# EasyEDA Pro project Avian.epro, schematic Avian_1

## Sheets
1 Power and sensors: Board Name: Avian_1; Create Date: 2026-01-29; Page Name: Power and sensors; Project Name: Avian; Schematic Name: Avian_1; Update Date: 2026-02-02; Company: EasyEDA.com; Page Size: A4; Version: V1.0
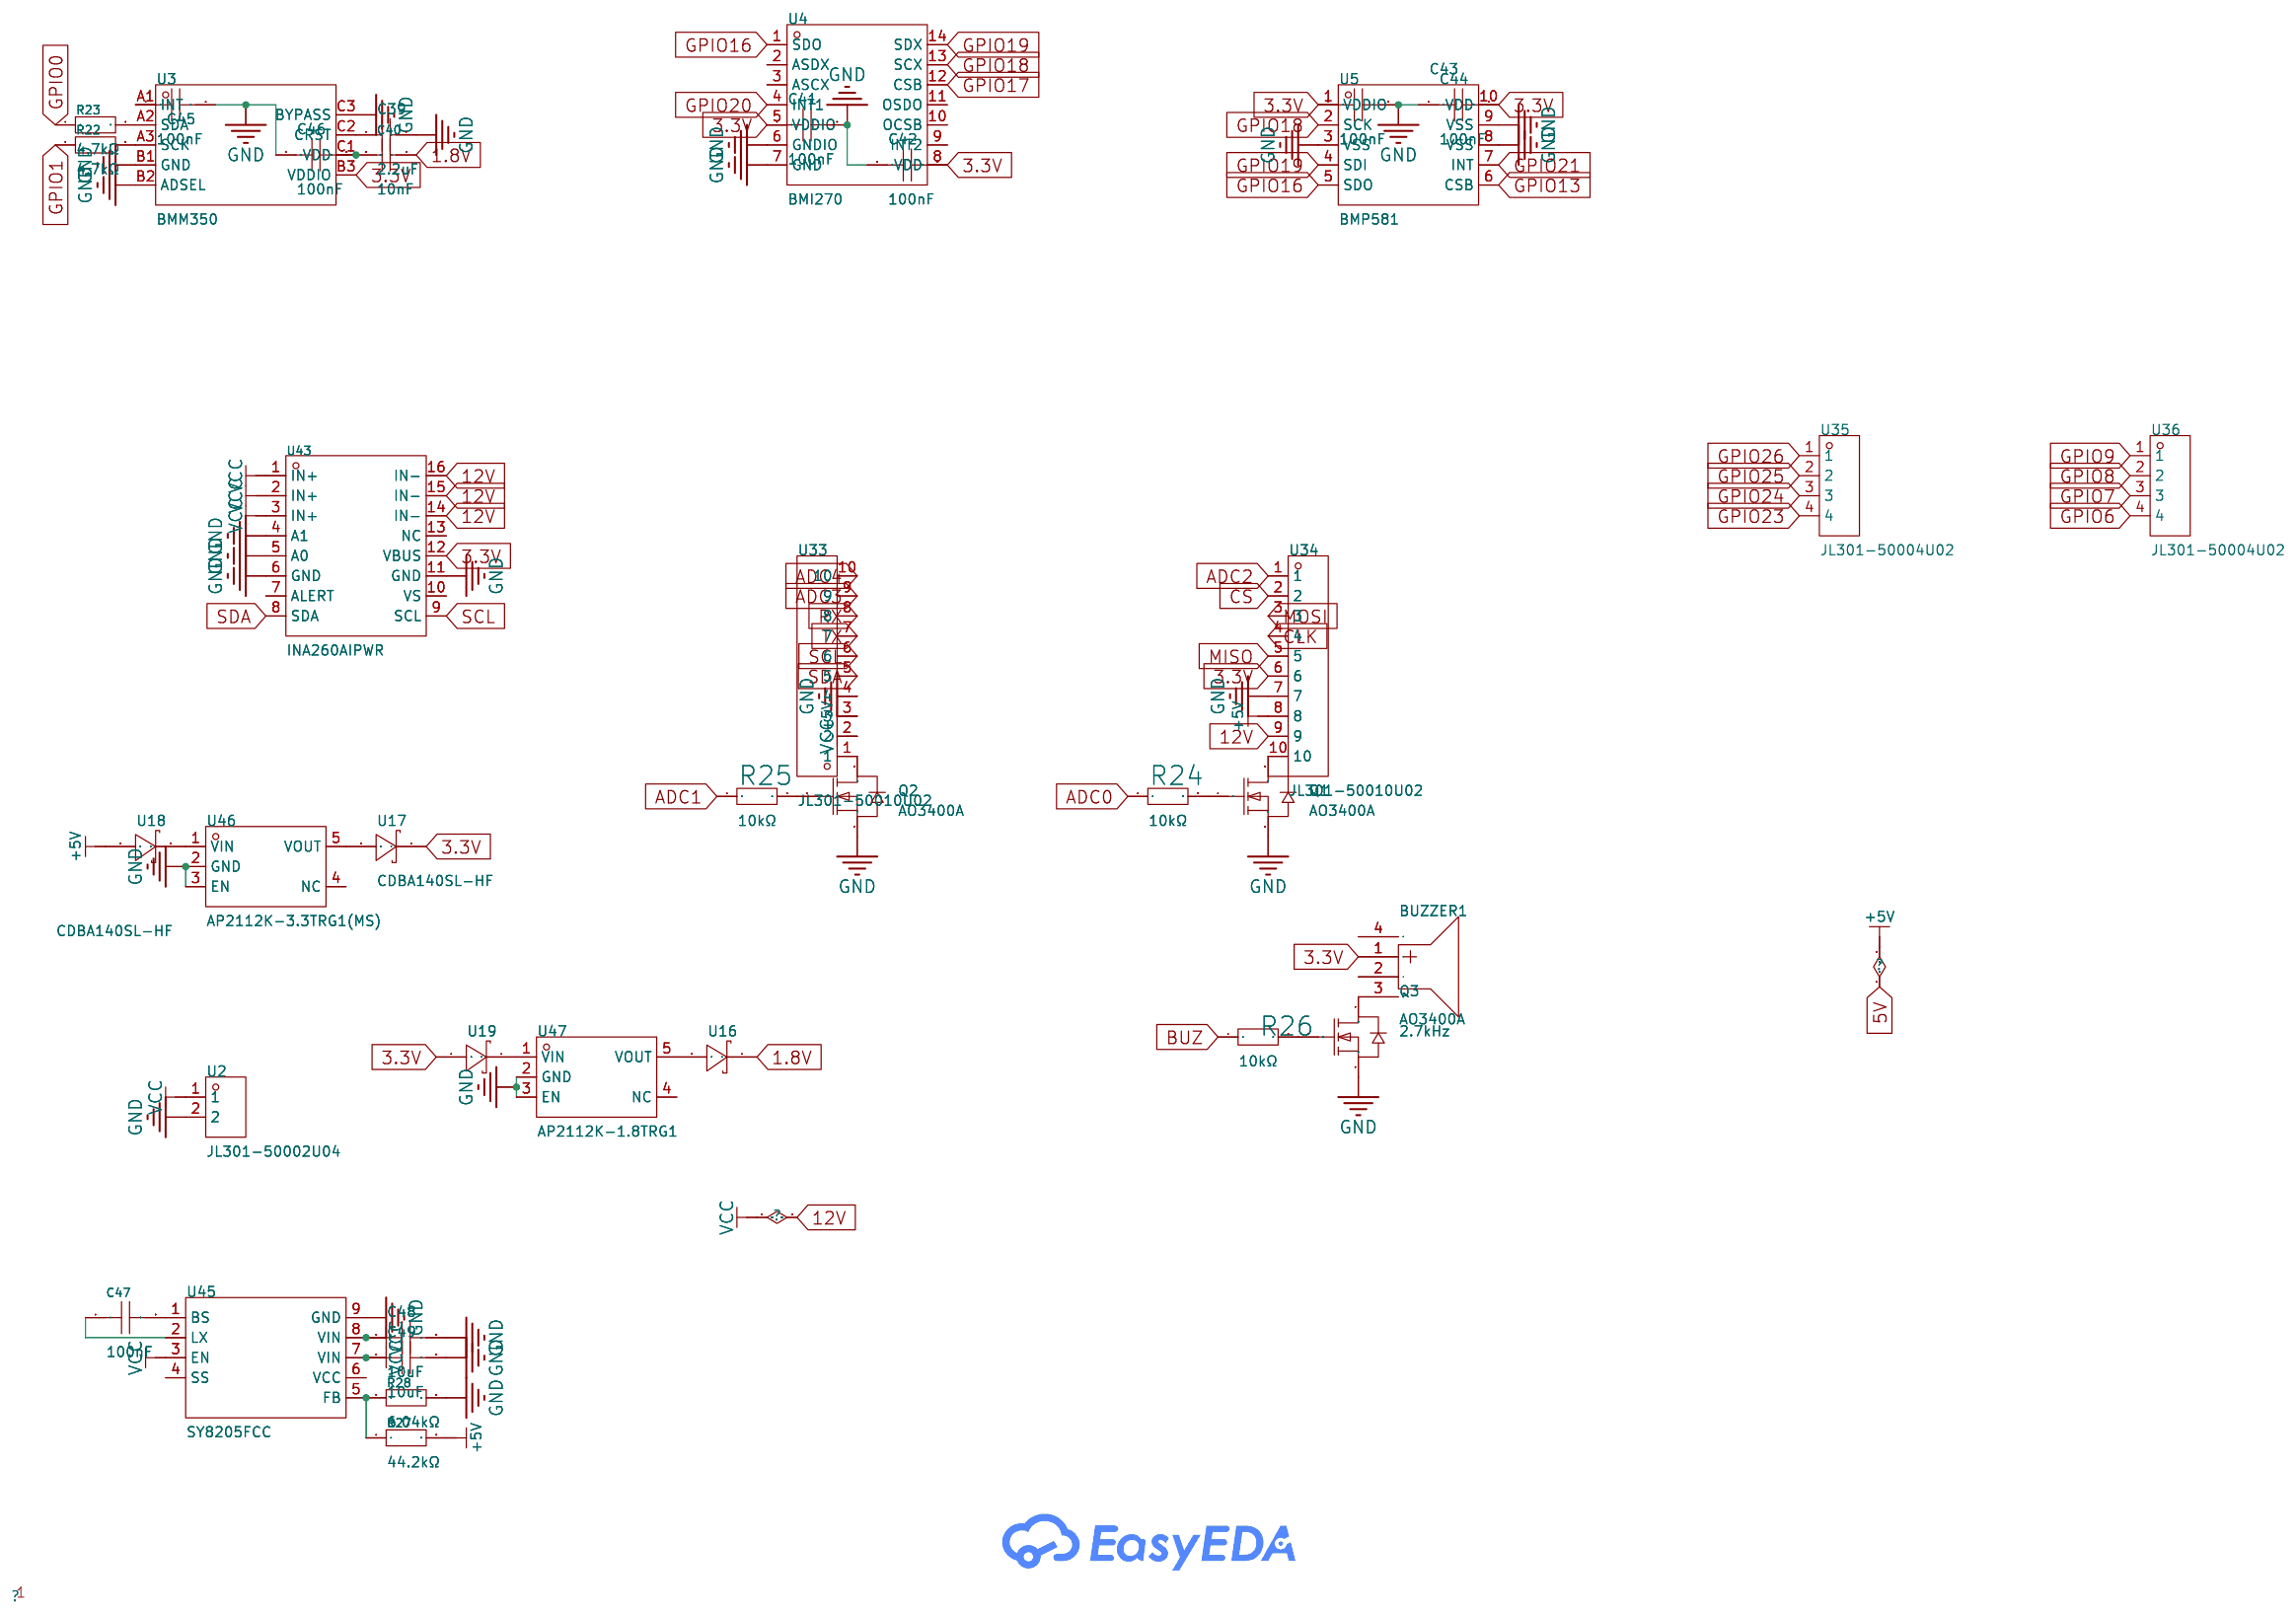
[diagram p0: Power and sensors]
2 MRPI: Page Name: MRPI; Update Date: 2026-02-01
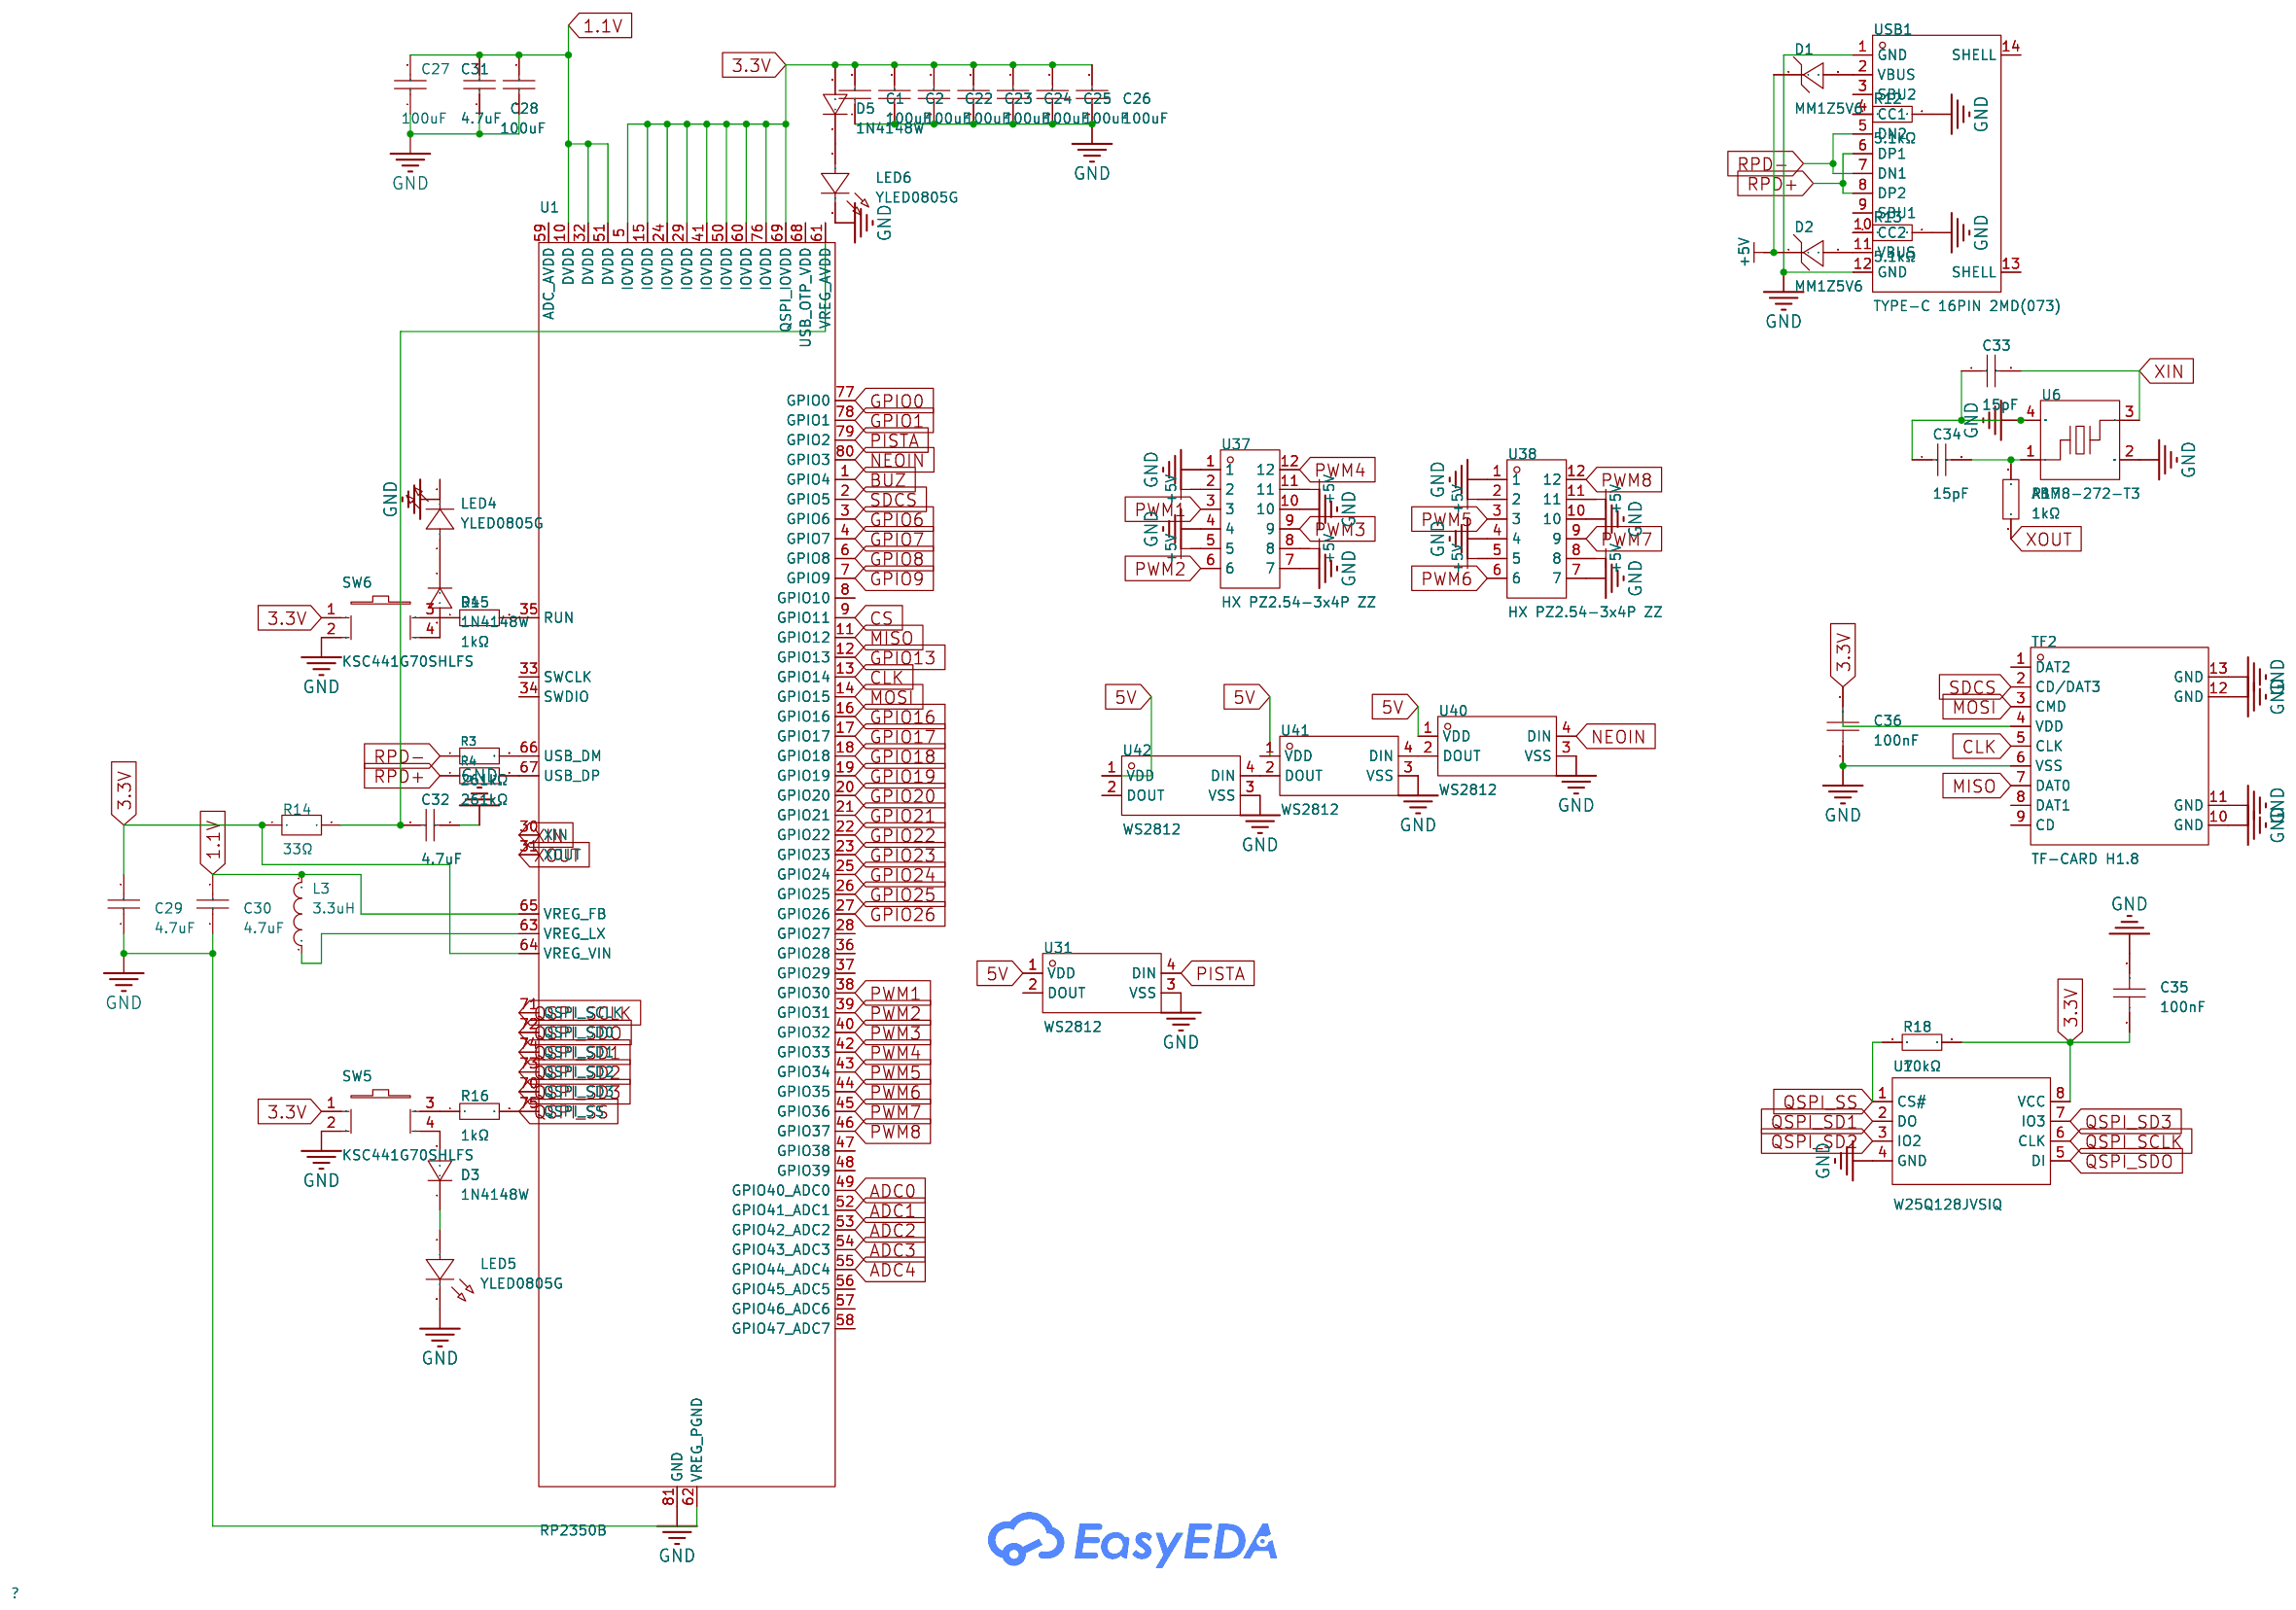
[diagram p1: MRPI]

## Parts
sheet MRPI
C1  100uF  [C1206]
C2  100uF  [C1206]
C22  100uF  [C1206]
C23  100uF  [C1206]
C24  100uF  [C1206]
C25  100uF  [C1206]
C26  100uF  [C1206]
C27  100uF  [C1206]
C28  100uF  [C1206]
C29  4.7uF  [C1206]
C30  4.7uF  [C1206]
C31  4.7uF  [C1206]
C32  4.7uF  [C1206]
C33  15pF  [C0603]
C34  15pF  [C0603]
C35  100nF  [C0603]
C36  100nF  [C0603]
D1  MM1Z5V6  [SOD-123_L2.8-W1.8-LS3.7-RD]
D2  MM1Z5V6  [SOD-123_L2.8-W1.8-LS3.7-RD]
D3  1N4148W  [SOD-123F_L2.7-W1.6-LS3.8-RD]
D4  1N4148W  [SOD-123F_L2.7-W1.6-LS3.8-RD]
D5  1N4148W  [SOD-123F_L2.7-W1.6-LS3.8-RD]
L3  3.3uH  [IND-SMD_L2.0-W1.6_AOTA-B201610S3R3-101-T]
LED4  YLED0805G  [LED0805-FD-GREEN]
LED5  YLED0805G  [LED0805-FD-GREEN]
LED6  YLED0805G  [LED0805-FD-GREEN]
R3  261kΩ  [R0603]
R4  261kΩ  [R0603]
R12  5.1kΩ  [R0805]
R13  5.1kΩ  [R0805]
R14  33Ω  [R0603]
R15  1kΩ  [R0603]
R16  1kΩ  [R0603]
R17  1kΩ  [R0603]
R18  10kΩ  [R0603]
SW5  KSC441G70SHLFS  [KEY--SMD_4P-L6.2-W6.2-P4.50-LS12.0]
SW6  KSC441G70SHLFS  [KEY--SMD_4P-L6.2-W6.2-P4.50-LS12.0]
TF2  TF-CARD H1.8  [TF-SMD_TF-CARD-H1.8]
U1  RP2350B  [QFN-80_L10.0-W10.0-P0.40-TL-EP3.4]
U6  ABM8-272-T3  [CRYSTAL-SMD_4P-L3.2-W2.5-BL]
U7  W25Q128JVSIQ  [SOIC-8_L5.3-W5.3-P1.27-LS8.0-BL]
U31  WS2812  [LED-SMD_4P-L5.0-W5.0-TL-A]
U37  HX PZ2.54-3x4P ZZ  [HDR-TH_12P-P2.54-V-M-R3-C4-S2.54]
U38  HX PZ2.54-3x4P ZZ  [HDR-TH_12P-P2.54-V-M-R3-C4-S2.54]
U40  WS2812  [LED-SMD_4P-L5.0-W5.0-TL-A]
U41  WS2812  [LED-SMD_4P-L5.0-W5.0-TL-A]
U42  WS2812  [LED-SMD_4P-L5.0-W5.0-TL-A]
USB1  TYPE-C 16PIN 2MD(073)  [USB-C-SMD_TYPE-C-6PIN-2MD-073]
sheet Power and sensors
BUZZER1  2.7kHz  [BUZ-SMD_4P-L7.5-W7.5-P7.59-TL]
C39  2.2uF  [C1206]
C40  10nF  [C0603]
C41  100nF  [C0603]
C42  100nF  [C0603]
C43  100nF  [C0603]
C44  100nF  [C0603]
C45  100nF  [C0603]
C46  100nF  [C0603]
C47  100nF  [C0603]
C48  10uF  [C0805]
C49  10uF  [C0805]
Q1  AO3400A  [SOT-23-3_L2.9-W1.3-P1.90-LS2.4-BR]
Q2  AO3400A  [SOT-23-3_L2.9-W1.3-P1.90-LS2.4-BR]
Q3  AO3400A  [SOT-23-3_L2.9-W1.3-P1.90-LS2.4-BR]
R22  4.7kΩ  [R1206]
R23  4.7kΩ  [R1206]
R24  10kΩ  [R0603]
R25  10kΩ  [R0603]
R26  10kΩ  [R0603]
R27  44.2kΩ  [R0402]
R28  6.04kΩ  [R0402]
U2  JL301-50002U04  [CONN-TH_JL301-50002U01]
U3  BMM350  [WLCSP-9_L1.3-W1.3-R3-C3-P0.40-TL]
U4  BMI270  [LGA-14_L3.0-W2.5-P0.50-BR]
U5  BMP581  [LGA-10_L2.0-W2.0-P0.50-TL_BMP581]
U16  CDBA140SL-HF  [DO-214AC_L4.3-W2.7-LS5.3-RD]
U17  CDBA140SL-HF  [DO-214AC_L4.3-W2.7-LS5.3-RD]
U18  CDBA140SL-HF  [DO-214AC_L4.3-W2.7-LS5.3-RD]
U19  CDBA140SL-HF  [DO-214AC_L4.3-W2.7-LS5.3-RD]
U33  JL301-50010U02  [CONN-TH_10P-P5.00_JL301-50010U02]
U34  JL301-50010U02  [CONN-TH_10P-P5.00_JL301-50010U02]
U35  JL301-50004U02  [CONN-TH_4P-P5.00_JL301-50004U02]
U36  JL301-50004U02  [CONN-TH_4P-P5.00_JL301-50004U02]
U43  INA260AIPWR  [TSSOP-16_L5.0-W4.4-P0.65-LS6.4-BL-1]
U45  SY8205FCC  [SOIC-8_L5.0-W4.0-P1.27-LS6.0-BL-EP2.0]
U46  AP2112K-3.3TRG1(MS)  [SOT-23-5_L2.9-W1.6-P0.95-LS2.7-BR]
U47  AP2112K-1.8TRG1  [SOT-25_L3.0-W1.6-P0.95-LS2.8-BL]

## Library data of the parts
C1 C2 C22-C28 = CL31A107MQHNNNE: Capacitance:100uF Tolerance:±20% Tolerance:±20% Voltage Rating:6.3V Temperature Coefficient:X5R; LCSC Part Name: 100uF ±20% 6.3V; Supplier Part: C15008; Manufacturer: SAMSUNG(三星); Supplier Footprint: 1206; Datasheet: https://item.szlcsc.com/datasheet/CL31A107MQHNNNE/15681.html; Supplier: LCSC; Tolerance: ±20%; Voltage Rating: 6.3V; Temperature Coefficient: X5R
C29-C32 = CL31B475KBHNNNE: Capacitance:4.7uF Tolerance:±10% Tolerance:±10% Voltage Rating:50V Temperature Coefficient:X7R; LCSC Part Name: 4.7uF ±10% 50V; Supplier Part: C51205; Manufacturer: SAMSUNG(三星); Supplier Footprint: 1206; Datasheet: https://item.szlcsc.com/datasheet/CL31B475KBHNNNE/52218.html; Supplier: LCSC; Tolerance: ±10%; Voltage Rating: 50V; Temperature Coefficient: X7R
C33 C34 = CL10C150JB8NNNC: Capacitance:15pF Tolerance:±5% Tolerance:±5% Voltage Rating:50V Temperature Coefficient:C0G; LCSC Part Name: 15pF ±5% 50V; Supplier Part: C1644; Manufacturer: SAMSUNG(三星); Supplier Footprint: 0603; JLCPCB Part Class: Basic Part; Datasheet: https://item.szlcsc.com/datasheet/CL10C150JB8NNNC/1996.html; Supplier: LCSC; Tolerance: ±5%; Voltage Rating: 50V; Temperature Coefficient: C0G
C35 C36 C41-C46 = CC0603KRX7R9BB104: Capacitance:100nF Tolerance:±10% Tolerance:±10% Voltage Rating:50V Temperature Coefficient:X7R; LCSC Part Name: 100nF ±10% 50V; Supplier Part: C14663; Manufacturer: YAGEO(国巨); Supplier Footprint: 0603; Datasheet: https://item.szlcsc.com/datasheet/CC0603KRX7R9BB104/15331.html; Supplier: LCSC; Tolerance: ±10%; Voltage Rating: 50V; Temperature Coefficient: X7R
D1 D2 = MM1Z5V6_C85210: Diode Configuration:Independent Type Zener Voltage (Nom):5.6V Reverse Leakage Current (Ir):1uA@2.5V Zener Voltage (Range):5.2V~6V Zener Voltage (Range):5.2V~6V Power Dissipation:500mW Zener Impedance (Zzt):80Ω; Supplier Part: C85210; Manufacturer: ST(先科); Supplier Footprint: SOD-123; Datasheet: https://atta.szlcsc.com/upload/public/pdf/source/20170914/C118610_1505373983764968880.pdf; Supplier: LCSC; Diode Configuration: Independent Type; Zener Voltage (Nom): 5.6V; Reverse Leakage Current (Ir): 1uA@2.5V; Zener Voltage (Range): 5.2V~6V; Power Dissipation: 500mW; Zener Impedance (Zzt): 80Ω
D3-D5 = 1N4148W_C81598: Diode Configuration:Independent Voltage - Forward(Vf@If):1V@50mA Voltage - DC Reverse(Vr):75V Current - Rectified:150mA Pd - Power Dissipation:400mW Reverse Leakage Current (Ir):1uA@75V Reverse Recovery Time (trr):4ns Operating Junction Temperature Range:; Supplier Part: C81598; Manufacturer: ST(先科); Supplier Footprint: SOD-123; JLCPCB Part Class: Basic Part; Datasheet: https://item.szlcsc.com/datasheet/1N4148W/82750.html; Supplier: LCSC; Diode Configuration: Independent; Voltage - Forward(Vf@If): 1V@50mA; Voltage - DC Reverse(Vr): 75V; Current - Rectified: 150mA; Pd - Power Dissipation: 400mW; Reverse Leakage Current (Ir): 1uA@75V; Reverse Recovery Time (trr): 4ns; Non-Repetitive Peak Forward Surge Current: 1A
L3 = AOTA-B201610S3R3-101-T: Inductance:3.3uH Current Rating:2.1A Current - Saturation(Isat):2.4A DC Resistance(DCR):115mΩ Type:Molded Inductor; LCSC Part Name: 3.3uH 2.4A; Supplier Part: C42411119; Manufacturer: ABRACON; Supplier Footprint: 0806; JLCPCB Part Class: Extended Part; Datasheet: https://item.szlcsc.com/datasheet/AOTA-B201610S3R3-101-T/44392932.html; Supplier: LCSC; Current Rating: 2.1A; Current - Saturation(Isat): 2.4A; DC Resistance(DCR): 115mΩ; Type: Molded Inductor
LED4-LED6 = YLED0805G: Lamp Holder Type:-；- Illumination Color:Emerald Green Voltage - Forward(Vf):2.4V~3.1V Voltage - Forward(Vf):2.4V~3.1V Power(Watts):70mW Forward Current:20mA Wavelength - Dominant:516nm~534nm Wavelength - Dominant:516nm~534nm Peak Wavelength:525nm Diode Co; LCSC Part Name: 发光管; Supplier Part: C25170728; Manufacturer: YONGYUTAI(永裕泰); Supplier Footprint: 0805; JLCPCB Part Class: Extended Part; Datasheet: https://item.szlcsc.com/datasheet/YLED0805G/26899175.html; Supplier: LCSC; Lamp Holder Type: -；-; Illumination Color: Emerald Green; Voltage - Forward(Vf): 2.4V~3.1V; Power(Watts): 70mW; Forward Current: 20mA; Wavelength - Dominant: 516nm~534nm; Peak Wavelength: 525nm; Diode Configuration: -；-; Lens Color: -；-; Luminous Intensity: 430mcd; Viewing Angle: 120°; Mounting Style: -；-; Operating Temperature: -40℃~+85℃
R3 R4 = 0603WAF2613T5E: Type:Thick Film Resistors Resistance:261kΩ Tolerance:±1% Tolerance:±1% Power(Watts): Overload Voltage (Max): Temperature Coefficient:±100ppm/℃ Temperature Coefficient:±100ppm/℃ Operating Temperature Range:-55℃~+155℃ Operating Temperature Range:-55℃~+155℃; LCSC Part Name: 261kΩ ±1% 100mW 厚膜电阻; Supplier Part: C23011; Manufacturer: UNI-ROYAL(厚声); Supplier Footprint: 0603; JLCPCB Part Class: Extended Part; Datasheet: https://atta.szlcsc.com/upload/public/pdf/source/20200306/C422600_1E6D84923E4A46A82E41ADD87F860B5C.pdf; Supplier: LCSC; Type: Thick Film Resistors; Tolerance: ±1%; Temperature Coefficient: ±100ppm/℃; Operating Temperature Range: -55℃~+155℃
R12 R13 = 0805W8F5101T5E: Type:Thick Film Resistor Resistance:5.1kΩ Tolerance:±1% Tolerance:±1% Power(Watts):125mW Voltage-Supply(Max):150V Temperature Coefficient:±100ppm/℃ Temperature Coefficient:±100ppm/℃ Operating Temperature:-55℃~+155℃ Operating Temperature:-55℃~+155℃; LCSC Part Name: 5.1kΩ ±1% 125mW 厚膜电阻; Supplier Part: C27834; Manufacturer: UNI-ROYAL(厚声); Supplier Footprint: 0805; JLCPCB Part Class: Basic Part; Datasheet: https://item.szlcsc.com/datasheet/0805W8F5101T5E/28584.html; Supplier: LCSC; Type: Thick Film Resistor; Tolerance: ±1%; Power(Watts): 125mW; Voltage-Supply(Max): 150V; Temperature Coefficient: ±100ppm/℃; Operating Temperature: -55℃~+155℃
R14 = FRC0603F33R0TS: Type:Thick Film Resistor Resistance:33Ω Tolerance:±1% Tolerance:±1% Power(Watts):100mW Voltage-Supply(Max):75V Temperature Coefficient:±100ppm/℃ Temperature Coefficient:±100ppm/℃ Operating Temperature:-55℃~+155℃ Operating Temperature:-55℃~+155℃; LCSC Part Name: 33Ω ±1% 100mW 厚膜电阻; Supplier Part: C2909394; Manufacturer: FOJAN(富捷); Supplier Footprint: 0603; JLCPCB Part Class: Extended Part; Supplier: LCSC; Type: Thick Film Resistor; Tolerance: ±1%; Power(Watts): 100mW; Voltage-Supply(Max): 75V; Temperature Coefficient: ±100ppm/℃; Operating Temperature: -55℃~+155℃
R15-R17 = RC0603FR-071KL: Type:Thick Film Resistor Resistance:1kΩ Tolerance:±1% Tolerance:±1% Power(Watts):100mW Voltage-Supply(Max):75V Temperature Coefficient:±100ppm/℃ Temperature Coefficient:±100ppm/℃ Operating Temperature:-55℃~+155℃ Operating Temperature:-55℃~+155℃; LCSC Part Name: 厚膜电阻 1kΩ ±1% 100mW; Supplier Part: C22548; Manufacturer: YAGEO(国巨); Supplier Footprint: 0603; JLCPCB Part Class: Extended Part; Datasheet: https://item.szlcsc.com/datasheet/RC0603FR-071KL/23274.html; Supplier: LCSC; Type: Thick Film Resistor; Tolerance: ±1%; Power(Watts): 100mW; Voltage-Supply(Max): 75V; Temperature Coefficient: ±100ppm/℃; Operating Temperature: -55℃~+155℃
R18 = RC0603FR-0710KL: Type:Thick Film Resistors Resistance: Tolerance:±1% Tolerance:±1% Power(Watts): Overload Voltage (Max): Temperature Coefficient:±100ppm/℃ Temperature Coefficient:±100ppm/℃ Operating Temperature Range:-55℃~+155℃ Operating Temperature Range:-55℃~+155℃; LCSC Part Name: 厚膜电阻 10kΩ ±1% 100mW; Supplier Part: C98220; Manufacturer: YAGEO(国巨); Supplier Footprint: 0603; JLCPCB Part Class: Extended Part; Datasheet: https://atta.szlcsc.com/upload/public/pdf/source/20180927/C295883_E8D83085EA81BD7DE0B2B681138C15EE.pdf; Supplier: LCSC; Type: Thick Film Resistors; Tolerance: ±1%; Temperature Coefficient: ±100ppm/℃; Operating Temperature Range: -55℃~+155℃
SW5 SW6 = KSC441G70SHLFS: Circuit:SPST Actuator Style:Round Button Operating Force:4N Mounting Type:Surface Mount,Vertical Length:6.2mm Width:6.2mm Switch Height:5.2mm Contact Current:50mA Voltage Rating:32V With Lamp:- IP Rating:IP67 Termination Style:Gull Wing Life:- Operating T; LCSC Part Name: 轻触开关6.2mm*6.2mm，4N; Supplier Part: C221747; Manufacturer: C&K; Supplier Footprint: SMD-4P,6.2x6.2mm; JLCPCB Part Class: Extended Part; Datasheet: https://item.szlcsc.com/datasheet/KSC441G70SHLFS/222177.html; Supplier: LCSC; Circuit: SPST; Actuator Style: Round Button; Operating Force: 4N; Mounting Type: Surface Mount,Vertical; Length: 6.2mm; Width: 6.2mm; Switch Height: 5.2mm; Contact Current: 50mA; Voltage Rating: 32V; IP Rating: IP67; Termination Style: Gull Wing; Operating Temperature: -40℃~+85℃
TF2 = TF-CARD H1.8: Card Connection Mode:Push-Push Card Type:MicroSD Card (TF Card) Connector Type:Connector and Ejector Additional Card Detection Pins:- Supplementary Features:- Height Above Board:1.8mm Operating Temperature:-40℃~+70℃ Operating Temperature:-40℃~+70℃; LCSC Part Name: 自弹式 MicroSD卡(TF卡) 卡座; Supplier Part: C7529389; Manufacturer: SHOU HAN(首韩); Supplier Footprint: SMD; Datasheet: https://item.szlcsc.com/datasheet/TF-CARD%2520H1.8/8629776.html; Supplier: LCSC; Card Connection Mode: Push-Push; Card Type: MicroSD Card (TF Card); Connector Type: Connector and Ejector; Height Above Board: 1.8mm; Operating Temperature: -40℃~+70℃
U1 = RP2350B_C42415655: LCSC Part Name: 微控制器; Supplier Part: C42415655; Manufacturer: Raspberry Pi(树莓派); Supplier Footprint: QFN-80-EP(10x10); JLCPCB Part Class: Extended Part; Datasheet: https://item.szlcsc.com/datasheet/RP2350B/44413055.html; Supplier: LCSC
U6 = ABM8-272-T3_C20625731: Supplier Part: C20625731; Manufacturer: ABRACON; Supplier Footprint: SMD3225-4P; JLCPCB Part Class: Extended Part; Datasheet: https://item.szlcsc.com/datasheet/ABM8-272-T3/22032038.html; Supplier: LCSC
U7 = W25Q128JVSIQ: Interface:SPI Memory Size:128Mbit Clock Frequency:133MHz Voltage - Supply:2.7V~3.6V Voltage - Supply:2.7V~3.6V Standby Supply Current:1uA Program / Erase Cycles:100,000 Cycles Page Programming Time (Tpp):3ms Block Erase Time(tBE):120ms@(32KB) Data Retenti; LCSC Part Name: 编带 支持双路/四路SPI接口的3V、128Mbit 串行闪存; Supplier Part: C97521; Manufacturer: Winbond(华邦); Supplier Footprint: SOIC-8-208mil; JLCPCB Part Class: Basic Part; Datasheet: https://item.szlcsc.com/datasheet/W25Q128JVSIQ/98729.html; Supplier: LCSC; Interface: SPI; Memory Size: 128Mbit; Clock Frequency: 133MHz; Voltage - Supply: 2.7V~3.6V; Standby Supply Current: 1uA; Program / Erase Cycles: 100,000 Cycles; Page Programming Time (Tpp): 3ms; Block Erase Time(tBE): 120ms@(32KB); Data Retention - TDR (Year): 20 Years; Operating Temperature: -40℃~+85℃
U31 U40-U42 = WS2812: Supplier Part: C42417498; Manufacturer: worldsemi; Supplier Footprint: SMD5050-4P; JLCPCB Part Class: Extended Part; Datasheet: https://item.szlcsc.com/datasheet/WS2812/44423158.html; Supplier: LCSC
U37 U38 = HX PZ2.54-3x4P ZZ: Pin Structure:3x4P Pitch:2.54mm Row Spacing:2.54mm Circluar Pins/Square Pins:Pin Header Mounting Type:Through Hole Number of Rows:3 Number of Pins:12P Current Rating:3A Voltage Rating (Max):1kV Length of Mating Pin:6mm Insulation Height:2.5mm Length of En; LCSC Part Name: 3x4P 间距:2.54mm 方针 直插; Supplier Part: C32713291; Manufacturer: hanxia(韩下); Supplier Footprint: 插件,P=2.54mm; JLCPCB Part Class: Extended Part; Datasheet: https://item.szlcsc.com/datasheet/HX%2520PZ2.54-3x4P%2520ZZ/34444571.html; Supplier: LCSC; Pin Structure: 3x4P; Pitch: 2.54mm; Row Spacing: 2.54mm; Circluar Pins/Square Pins: Pin Header; Mounting Type: Through Hole; Number of Rows: 3; Number of Pins: 12P; Current Rating: 3A; Voltage Rating (Max): 1kV; Length of Mating Pin: 6mm; Insulation Height: 2.5mm; Length of End Connection Pin: 3mm; Contact Material: Brass; Contact Plating: Gold; Operating Temperature: -40℃~+105℃; Color: Black
USB1 = TYPE-C 16PIN 2MD(073): Connector Type:Type-C Protocol Standard:- Gender:Female Mounting Type:Surface Mount, Right Angle Number of Contacts:16P Number of Ports:1 Current Rating-Power:3A Voltage Rating:5V Connect-Disconnect Life:5,000 Cycles Supplementary Features:- Center Height; LCSC Part Name: Type-C 母 卧贴; Supplier Part: C2765186; Manufacturer: SHOU HAN(首韩); Supplier Footprint: SMD; Datasheet: https://item.szlcsc.com/datasheet/TYPE-C%252016PIN%25202MD(073)/2901843.html; Supplier: LCSC; Connector Type: Type-C; Gender: Female; Mounting Type: Surface Mount, Right Angle; Number of Contacts: 16P; Number of Ports: 1; Current Rating-Power: 3A; Voltage Rating: 5V; Connect-Disconnect Life: 5,000 Cycles; Detection color: Black; Operating Temperature: -25℃~+85℃
BUZZER1 = MLT-7525: Driver Circuitry:Passive (Externally Driven) Technology:Electromagnetic Voltage Rating:3.6V Voltage - Supply:2.5V~4.5V Voltage - Supply:2.5V~4.5V Frequency:2.7kHz Current Consumption:95mA Sound Pressure Level(SPL):80dB Length:7.5mm Width:7.5mm Height:2.8m; LCSC Part Name: 无源(外部驱动) 电磁式 2.7kHz; Supplier Part: C95299; Manufacturer: 华能; Supplier Footprint: SMD,7.5x7.5mm; JLCPCB Part Class: Extended Part; Datasheet: https://item.szlcsc.com/datasheet/MLT-7525/96501.html; Supplier: LCSC; Driver Circuitry: Passive (Externally Driven); Technology: Electromagnetic; Voltage Rating: 3.6V; Voltage - Supply: 2.5V~4.5V; Current Consumption: 95mA; Sound Pressure Level(SPL): 80dB; Length: 7.5mm; Width: 7.5mm; Height: 2.8mm; Operating Temperature: -20℃~+70℃
C39 = CL31B225KBHNNNE: Capacitance:2.2uF Tolerance:±10% Tolerance:±10% Voltage Rating:50V Temperature Coefficient:X7R; LCSC Part Name: 2.2uF ±10% 50V; Supplier Part: C50254; Manufacturer: SAMSUNG(三星); Supplier Footprint: 1206; Datasheet: https://item.szlcsc.com/datasheet/CL31B225KBHNNNE/51263.html; Supplier: LCSC; Tolerance: ±10%; Voltage Rating: 50V; Temperature Coefficient: X7R
C40 = CC0603KRX7R9BB103: Capacitance:10nF Tolerance:±10% Tolerance:±10% Voltage Rating:50V Temperature Coefficient:X7R; LCSC Part Name: 10nF ±10% 50V; Supplier Part: C100042; Manufacturer: YAGEO(国巨); Supplier Footprint: 0603; JLCPCB Part Class: Extended Part; Datasheet: https://item.szlcsc.com/datasheet/CC0603KRX7R9BB103/101256.html; Supplier: LCSC; Tolerance: ±10%; Voltage Rating: 50V; Temperature Coefficient: X7R
C47 = CL10B104KB8NNNC: Capacitance:100nF Tolerance:±10% Tolerance:±10% Voltage Rating:50V Temperature Coefficient:X7R; LCSC Part Name: 100nF ±10% 50V; Supplier Part: C1591; Manufacturer: SAMSUNG(三星); Supplier Footprint: 0603; JLCPCB Part Class: Extended Part; Datasheet: https://item.szlcsc.com/datasheet/CL10B104KB8NNNC/1943.html; Supplier: LCSC; Tolerance: ±10%; Voltage Rating: 50V; Temperature Coefficient: X7R
C48 C49 = CL21B106KOQNNNE: Capacitance:10uF Tolerance:±10% Tolerance:±10% Voltage Rating:16V Temperature Coefficient:X7R; LCSC Part Name: 10uF ±10% 16V; Supplier Part: C95841; Manufacturer: SAMSUNG(三星); Supplier Footprint: 0805; Datasheet: https://item.szlcsc.com/datasheet/CL21B106KOQNNNE/97045.html; Supplier: LCSC; Tolerance: ±10%; Voltage Rating: 16V; Temperature Coefficient: X7R
Q1-Q3 = AO3400A_C20917: Number:- Drain to Source Voltage:30V Current - Continuous Drain(Id):- RDS(on):48mΩ@2.5V Pd - Power Dissipation:- Gate Threshold Voltage (Vgs(th)):1.45V@250uA Gate Charge(Qg):7nC@10V Input Capacitance(Ciss):630pF@15V Reverse Transfer Capacitance (Crss@Vds); LCSC Part Name: 1个N沟道 耐压:30V 电流:5.7A; Supplier Part: C20917; Manufacturer: AOS; Supplier Footprint: SOT-23-3L; JLCPCB Part Class: Basic Part; Datasheet: https://item.szlcsc.com/datasheet/AO3400A/21629.html; Supplier: LCSC; Drain to Source Voltage: 30V; RDS(on): 48mΩ@2.5V; Gate Threshold Voltage (Vgs(th)): 1.45V@250uA; Gate Charge(Qg): 7nC@10V; Input Capacitance(Ciss): 630pF@15V; Operating Temperature: -55℃~+150℃@(Tj); Type: N-Channel
R22 R23 = RMC12064.7K1%N: Type:Thick Film Resistor Resistance:4.7kΩ Tolerance:±1% Tolerance:±1% Power(Watts):250mW Voltage-Supply(Max):200V Temperature Coefficient:±100ppm/℃ Temperature Coefficient:±100ppm/℃ Operating Temperature:-55℃~+155℃ Operating Temperature:-55℃~+155℃; LCSC Part Name: 厚膜电阻 4.7kΩ ±1% 250mW; Supplier Part: C269592; Manufacturer: Tyohm(幸亚电阻); Supplier Footprint: 1206; JLCPCB Part Class: Extended Part; Datasheet: https://item.szlcsc.com/datasheet/RMC12064.7K1%2525N/259032.html; Supplier: LCSC; Type: Thick Film Resistor; Tolerance: ±1%; Power(Watts): 250mW; Voltage-Supply(Max): 200V; Temperature Coefficient: ±100ppm/℃; Operating Temperature: -55℃~+155℃
R24-R26 = 0603WAF1002T5E: Type:Thick Film Resistor Resistance:10kΩ Tolerance:±1% Tolerance:±1% Power(Watts):100mW Voltage-Supply(Max):75V Temperature Coefficient:±100ppm/℃ Temperature Coefficient:±100ppm/℃ Operating Temperature:-55℃~+155℃ Operating Temperature:-55℃~+155℃; LCSC Part Name: 厚膜电阻 10kΩ ±1% 100mW; Supplier Part: C25804; Manufacturer: UNI-ROYAL(厚声); Supplier Footprint: 0603; JLCPCB Part Class: Basic Part; Datasheet: https://item.szlcsc.com/datasheet/0603WAF1002T5E/26547.html; Supplier: LCSC; Type: Thick Film Resistor; Tolerance: ±1%; Power(Watts): 100mW; Voltage-Supply(Max): 75V; Temperature Coefficient: ±100ppm/℃; Operating Temperature: -55℃~+155℃
R27 = RMC040244.2K1%N: Type:Thick Film Resistor Resistance:44.2kΩ Tolerance:±1% Tolerance:±1% Power(Watts):62.5mW Voltage-Supply(Max):50V Temperature Coefficient:±100ppm/℃ Temperature Coefficient:±100ppm/℃ Operating Temperature:-55℃~+155℃ Operating Temperature:-55℃~+155℃; LCSC Part Name: 厚膜电阻 44.2kΩ ±1% 62.5mW; Supplier Part: C325546; Manufacturer: Tyohm(幸亚电阻); Supplier Footprint: 0402; JLCPCB Part Class: Extended Part; Datasheet: https://item.szlcsc.com/datasheet/RMC040244.2K1%2525N/305751.html; Supplier: LCSC; Type: Thick Film Resistor; Tolerance: ±1%; Power(Watts): 62.5mW; Voltage-Supply(Max): 50V; Temperature Coefficient: ±100ppm/℃; Operating Temperature: -55℃~+155℃
R28 = RMC04026.04K1%N: Type:Thick Film Resistor Resistance:6.04kΩ Tolerance:±1% Tolerance:±1% Power(Watts):62.5mW Voltage-Supply(Max):50V Temperature Coefficient:±100ppm/℃ Temperature Coefficient:±100ppm/℃ Operating Temperature:-55℃~+155℃ Operating Temperature:-55℃~+155℃; LCSC Part Name: 厚膜电阻 6.04kΩ ±1% 62.5mW; Supplier Part: C325548; Manufacturer: Tyohm(幸亚电阻); Supplier Footprint: 0402; Datasheet: https://item.szlcsc.com/datasheet/RMC04026.04K1%2525N/305753.html; Supplier: LCSC; Type: Thick Film Resistor; Tolerance: ±1%; Power(Watts): 62.5mW; Voltage-Supply(Max): 50V; Temperature Coefficient: ±100ppm/℃; Operating Temperature: -55℃~+155℃
U2 = JL301-50002U04: Number of Positions or Pins:1x2P Pitch:5mm Color:Blue Mounting Type:Through Hole Number of Pins:2P Number of Rows:1 Number of PINs Per Row:2 Screw Specification:M2.5 Current Rating:15A Voltage Rating (Max):300V Wire Gauge - AWG:12~24 Operating Temperature; LCSC Part Name: 1x2P 5mm 直插 排数:1 每排P数:2; Supplier Part: C1509679; Manufacturer: JILN(锦凌); Supplier Footprint: 插件,P=5mm; JLCPCB Part Class: Extended Part; Datasheet: https://item.szlcsc.com/datasheet/JL301-50002U04/1600353.html; Supplier: LCSC; Number of Positions or Pins: 1x2P; Pitch: 5mm; Color: Blue; Mounting Type: Through Hole; Number of Pins: 2P; Number of Rows: 1; Number of PINs Per Row: 2; Screw Specification: M2.5; Current Rating: 15A; Voltage Rating (Max): 300V; Wire Gauge - AWG: 12~24; Operating Temperature: -40℃~+105℃
U3 = BMM350_C17225907: LCSC Part Name: BMM350 转接板 3.0; Supplier Part: C17225907; Manufacturer: Bosch(博世); Supplier Footprint: WLCSP-9(1.3x1.3); JLCPCB Part Class: Extended Part; Datasheet: https://item.szlcsc.com/datasheet/BMM350/18354996.html; Supplier: LCSC
U4 = BMI270: Sensor Type:加速度计陀螺仪 Operating Temperature:-40℃~+85℃ Operating Temperature:-40℃~+85℃; Supplier Part: C2836813; Manufacturer: Bosch(博世); Supplier Footprint: LGA-14(2.5x3); Datasheet: https://atta.szlcsc.com/upload/public/pdf/source/20210625/C2836813_35E1F3F92097F45A3828DF13DDBA01A5.pdf; Supplier: LCSC; Sensor Type: 加速度计陀螺仪; Operating Temperature: -40℃~+85℃
U5 = BMP581: Pressure range:30Kpa~1.25bar Pressure range:30Kpa~1.25bar Voltage - Supply:1.71V~3.6V Voltage - Supply:1.71V~3.6V Standby Current:1uA Interface:I3C；SpI；I2C Operating Temperature:-40℃~+85℃ Operating Temperature:-40℃~+85℃ Relative Accuracy:6pa Temperature C; LCSC Part Name: 气压传感器; Supplier Part: C5362283; Manufacturer: Bosch(博世); Supplier Footprint: LGA-10(2x2); JLCPCB Part Class: Extended Part; Datasheet: https://item.szlcsc.com/datasheet/BMP581/6186766.html; Supplier: LCSC; Pressure range: 30Kpa~1.25bar; Voltage - Supply: 1.71V~3.6V; Standby Current: 1uA; Interface: I3C；SpI；I2C; Operating Temperature: -40℃~+85℃; Relative Accuracy: 6pa; Temperature Coefficient of Offset(TCO): 0.5pa/K
U16-U19 = CDBA140SL-HF: Diode Configuration:Independent Type Forward Voltage (Vf@If):270mV@1A Reverse Voltage (Vr):40V Rectified Current:1A Reverse Leakage Current (Ir):200uA@40V; LCSC Part Name: 电压:40V 电流:1A; Supplier Part: C3012747; Manufacturer: Comchip(典琦); Supplier Footprint: SMA(DO-214AC); JLCPCB Part Class: Extended Part; Datasheet: https://atta.szlcsc.com/upload/public/pdf/source/20220509/162A5C6B49991143F34B2FD163CA218E.pdf; Supplier: LCSC; Diode Configuration: Independent Type; Forward Voltage (Vf@If): 270mV@1A; Reverse Voltage (Vr): 40V; Rectified Current: 1A; Reverse Leakage Current (Ir): 200uA@40V
U33 U34 = JL301-50010U02: Number of Positions or Pins:1x10P Pitch:5mm Color:Blue Mounting Type:Through Hole Number of Pins:10P Number of Rows:1 Number of PINs Per Row:10 Screw Specification:M2.5 Current Rating:15A Voltage Rating (Max):300V Wire Gauge - AWG:12~24 Operating Temperat; LCSC Part Name: 1x10P 5mm 直插 排数:1 每排P数:10; Supplier Part: C409141; Manufacturer: JILN(锦凌); Supplier Footprint: 插件,P=5mm; JLCPCB Part Class: Extended Part; Datasheet: https://item.szlcsc.com/datasheet/JL301-50010U02/399071.html; Supplier: LCSC; Number of Positions or Pins: 1x10P; Pitch: 5mm; Color: Blue; Mounting Type: Through Hole; Number of Pins: 10P; Number of Rows: 1; Number of PINs Per Row: 10; Screw Specification: M2.5; Current Rating: 15A; Voltage Rating (Max): 300V; Wire Gauge - AWG: 12~24; Operating Temperature: -40℃~+105℃
U35 U36 = JL301-50004U02: Number of Positions or Pins:1x4P Pitch:5mm Color:Blue Mounting Type:Through Hole Number of Pins:4P Number of Rows:1 Screw Specification:M2.5 Current Rating:15A Voltage Rating (Max):300V Wire Gauge - AWG:12~24; LCSC Part Name: 1x4P 5mm 直插 排数:1; Supplier Part: C409137; Manufacturer: JILN(锦凌); Supplier Footprint: 插件,P=5mm; JLCPCB Part Class: Extended Part; Datasheet: https://item.szlcsc.com/datasheet/JL301-50004U02/399067.html; Supplier: LCSC; Number of Positions or Pins: 1x4P; Pitch: 5mm; Color: Blue; Mounting Type: Through Hole; Number of Pins: 4P; Number of Rows: 1; Screw Specification: M2.5; Current Rating: 15A; Voltage Rating (Max): 300V; Wire Gauge - AWG: 12~24
U43 = INA260AIPWR: LCSC Part Name: 具有低漂移、高精度集成分流器的精密电流和功率监测计; Supplier Part: C2155885; Manufacturer: TI(德州仪器); Supplier Footprint: TSSOP-16; Datasheet: https://www.ti.com/cn/lit/gpn/ina260; Supplier: LCSC
U45 = SY8205FCC: Function:Buck Output Type:Adjustable Voltage - Supply:4.5V~30V Voltage - Supply:4.5V~30V Output Voltage:- Output Voltage:- Output Current:5A Frequency - Switching:500kHz Frequency - Switching:500kHz Operating Temperature:-40℃~+85℃@(TA) Operating Temperatu; LCSC Part Name: 高效快速响应5A 30V输入同步降压稳压器; Supplier Part: C111875; Manufacturer: Silergy(矽力杰); Supplier Footprint: SOIC-8-EP; JLCPCB Part Class: Extended Part; Datasheet: https://item.szlcsc.com/datasheet/SY8205FCC/113104.html; Supplier: LCSC; Function: Buck; Output Type: Adjustable; Voltage - Supply: 4.5V~30V; Output Current: 5A; Frequency - Switching: 500kHz; Operating Temperature: -40℃~+85℃@(TA); Synchronous Rectifier: Yes; Number of Outputs: 1; Topology: Buck; Quiescent Current: 200uA; Switch tube (built-in/external): Built-in
U46 = AP2112K-3.3TRG1(MS): Output Type:Fixed Voltage - Supply:6V Output Voltage:3.3V Output Voltage:3.3V Output Current:600mA Power Supply Rejection Ratio (PSRR):75dB@(1kHz) Voltage Dropout:- standby current:2uA Noise:- Features:Automatic Discharge Function；Low ESR；Overheat protect; Supplier Part: C22365427; Manufacturer: MSKSEMI(美森科); Supplier Footprint: SOT-23-5; Datasheet: https://item.szlcsc.com/datasheet/AP2112K-3.3TRG1(MS)/23832169.html; Supplier: LCSC; Output Type: Fixed; Voltage - Supply: 6V; Output Voltage: 3.3V; Output Current: 600mA; Power Supply Rejection Ratio (PSRR): 75dB@(1kHz); standby current: 2uA; Features: Automatic Discharge Function；Low ESR；Overheat protection；Overcurrent Protection；With ability; Operating Temperature: -40℃~+125℃@(Tj); Output Configuration: Positive electrode; Number of Outputs: 1
U47 = AP2112K-1.8TRG1: Output Type:Fixed Voltage - Supply:6V Output Voltage:1.8V Output Voltage:1.8V Output Current:600mA Power Supply Rejection Ratio (PSRR):65dB@(1kHz) Voltage Dropout:500mV@(600mA) standby current:55uA Noise:50uVrms Features:Over Current Protection；Enable；Ove; LCSC Part Name: 1.8V 600mA 6V; Supplier Part: C176944; Manufacturer: DIODES(美台); Supplier Footprint: SOT-25; JLCPCB Part Class: Extended Part; Datasheet: https://item.szlcsc.com/datasheet/AP2112K-1.8TRG1/188335.html; Supplier: LCSC; Output Type: Fixed; Voltage - Supply: 6V; Output Voltage: 1.8V; Output Current: 600mA; Power Supply Rejection Ratio (PSRR): 65dB@(1kHz); Voltage Dropout: 500mV@(600mA); standby current: 55uA; Noise: 50uVrms; Features: Over Current Protection；Enable；Over Temperature Protection; Operating Temperature: -40℃~+85℃@(Ta); Output Configuration: Positive; Number of Outputs: 1

## Nets
1.1V: C27.2 C28.2 C30.2 C31.2 L3.2 U1.10(DVDD) U1.32(DVDD) U1.51(DVDD) U1.65(VREG_FB)
1.8V: C40.2 U16.1
3.3V: BUZZER1.1(+) C1.2 C2.2 C22.2 C23.2 C24.2 C25.2 C26.2 C29.2 C35.1 C36.2 C41.1 C42.2 C43.1 C44.2 D5.2(A) R14.1 R18.2 SW5.1 SW6.1 TF2.4(VDD) U1.5(IOVDD) U1.15(IOVDD) U1.24(IOVDD) U1.29(IOVDD) U1.41(IOVDD) U1.50(IOVDD) U1.60(IOVDD) U1.64(VREG_VIN) U1.69(QSPI_IOVDD) U1.76(IOVDD) U3.B3(VDDIO) U4.5(VDDIO) U4.8(VDD) U5.1(VDDIO) U5.10(VDD) U7.8(VCC) U17.1 U19.2 U34.6 U43.12(VBUS)
+5V: D1.1(K) D2.1(K) R27.2 U18.2 U31.1(VDD) U33.3 U34.8 U37.2 U37.5 U37.8 U37.11 U38.2 U38.5 U38.8 U38.11 U40.1(VDD) U41.1(VDD) U42.1(VDD)
GND: C1.1 C2.1 C22.1 C23.1 C24.1 C25.1 C26.1 C27.1 C28.1 C29.1 C30.1 C31.1 C32.2 C33.1 C34.1 C35.2 C36.1 C39.2 C41.2 C42.1 C43.2 C44.1 C45.2 C46.1 C48.2 C49.2 LED4.2(K) LED5.2(K) LED6.2(K) Q1.2(S) Q2.2(S) Q3.2(S) R12.2 R13.2 R28.2 SW5.2 SW6.2 TF2.6(VSS) TF2.10(GND) TF2.11(GND) TF2.12(GND) TF2.13(GND) U1.62(VREG_PGND) U1.81(GND) U2.2 U3.B1(GND) U3.B2(ADSEL) U3.C3(BYPASS) U4.6(GNDIO) U4.7(GND) U5.3(VSS) U5.8(VSS) U5.9(VSS) U6.2(GND) U6.4(GND) U7.4(GND) U31.3(VSS) U33.4 U34.7 U37.1 U37.4 U37.7 U37.10 U38.1 U38.4 U38.7 U38.10 U40.3(VSS) U41.3(VSS) U42.3(VSS) U43.4(A1) U43.5(A0) U43.6(GND) U43.11(GND) U45.9(GND) U46.2(GND) U46.3(EN) U47.2(GND) U47.3(EN) USB1.1(GND) USB1.12(GND)
VCC: C48.1 C49.1 U2.1 U33.2 U34.9 U43.1(IN+) U43.2(IN+) U43.3(IN+) U43.14(IN-) U43.15(IN-) U43.16(IN-) U45.3(EN) U45.7(VIN) U45.8(VIN)
ADC0: R24.1 U1.49(GPIO40_ADC0)
ADC1: R25.1 U1.52(GPIO41_ADC1)
ADC2: U1.53(GPIO42_ADC2) U34.1
ADC3: U1.54(GPIO43_ADC3) U33.9
ADC4: U1.55(GPIO44_ADC4) U33.10
BUZ: R26.1 U1.1(GPIO4)
CLK: TF2.5(CLK) U1.13(GPIO14) U34.4
CS: U1.9(GPIO11) U34.2
GPIO0: R23.1 U1.77(GPIO0)
GPIO1: R22.1 U1.78(GPIO1)
GPIO6: U1.3(GPIO6) U36.4
GPIO7: U1.4(GPIO7) U36.3
GPIO8: U1.6(GPIO8) U36.2
GPIO9: U1.7(GPIO9) U36.1
GPIO13: U1.12(GPIO13) U5.6(CSB)
GPIO16: U1.16(GPIO16) U4.1(SDO) U5.5(SDO)
GPIO17: U1.17(GPIO17) U4.12(CSB)
GPIO18: U1.18(GPIO18) U4.13(SCX) U5.2(SCK)
GPIO19: U1.19(GPIO19) U4.14(SDX) U5.4(SDI)
GPIO20: U1.20(GPIO20) U4.4(INT1)
GPIO21: U1.21(GPIO21) U5.7(INT)
GPIO22: U1.22(GPIO22)
GPIO23: U1.23(GPIO23) U35.4
GPIO24: U1.25(GPIO24) U35.3
GPIO25: U1.26(GPIO25) U35.2
GPIO26: U1.27(GPIO26) U35.1
MISO: TF2.7(DAT0) U1.11(GPIO12) U34.5
MOSI: TF2.3(CMD) U1.14(GPIO15) U34.3
NEOIN: U1.80(GPIO3) U40.4(DIN)
PISTA: U1.79(GPIO2) U31.4(DIN)
PWM1: U1.38(GPIO30) U37.3
PWM2: U1.39(GPIO31) U37.6
PWM3: U1.40(GPIO32) U37.9
PWM4: U1.42(GPIO33) U37.12
PWM5: U1.43(GPIO34) U38.3
PWM6: U1.44(GPIO35) U38.6
PWM7: U1.45(GPIO36) U38.9
PWM8: U1.46(GPIO37) U38.12
QSPI_SCLK: U1.71(QSPI_SCLK) U7.6(CLK)
QSPI_SD1: U1.74(QSPI_SD1) U7.2(DO)
QSPI_SD2: U1.73(QSPI_SD2) U7.3(IO2)
QSPI_SD3: U1.70(QSPI_SD3) U7.7(IO3)
QSPI_SDO: U1.72(QSPI_SD0) U7.5(DI)
QSPI_SS: R16.2 R18.1 U1.75(QSPI_SS) U7.1(CS#)
RPD+: R4.1 USB1.6(DP1) USB1.8(DP2)
RPD-: R3.1 USB1.5(DN2) USB1.7(DN1)
RX: U33.8
SCL: U33.6 U43.9(SCL)
SDA: U33.5 U43.8(SDA)
SDCS: TF2.2(CD/DAT3) U1.2(GPIO5)
TX: U33.7
XIN: C33.2 U1.30(XIN) U6.3
XOUT: R17.1 U1.31(XOUT)
$3N22330: Q3.1(G) R26.2
$3N25501: Q1.3(D) U34.10
$3N25503: Q1.1(G) R24.2
$3N26223: Q2.1(G) R25.2
$3N26229: Q2.3(D) U33.1
$3N29548: C47.2 U45.1(BS)
$3N29821: U17.2 U46.5(VOUT)
$3N29823: U18.1 U46.1(VIN)
$3N29825: U16.2 U47.5(VOUT)
$3N29827: U19.1 U47.1(VIN)
$3N29841: C47.1 U45.2(LX)
$3N29881: R27.1 R28.1 U45.5(FB)
$5N714: R3.2 U1.66(USB_DM)
$5N753: R4.2 U1.67(USB_DP)
$5N865: R12.1 USB1.4(CC1)
$5N907: R13.1 USB1.10(CC2)
$5N1500: L3.1 U1.63(VREG_LX)
$5N1577: C32.1 R14.2 U1.61(VREG_AVDD)
$5N3555: R15.2 U1.35(RUN)
$5N4367: D5.1(K) LED6.1(A)
$5N4916: C34.2 R17.2 U6.1
$5N18524: U40.2(DOUT) U41.4(DIN)
$5N18586: U41.2(DOUT) U42.4(DIN)
$5N24177: D1.2(A) USB1.2(VBUS)
$5N24251: D2.2(A) USB1.11(VBUS)
Net-(BUZZER1-3): BUZZER1.3 Q3.3(D)
Net-(C39-1): C39.1 U3.C2(CRST)
Net-(C40-1): C40.1 C46.2 U3.C1(VDD)
Net-(C45-1): C45.1 U3.A1(INT)
Net-(D3-1): D3.1(K) LED5.1(A)
Net-(D3-2): D3.2(A) SW5.4
Net-(D4-1): D4.1(K) LED4.1(A)
Net-(D4-2): D4.2(A) SW6.4
Net-(R15-1): R15.1 SW6.3
Net-(R16-1): R16.1 SW5.3
Net-(R22-2): R22.2 U3.A3(SCK)
Net-(R23-2): R23.2 U3.A2(SDA)

Not connected (* = marked no-connect by the designer): BUZZER1 2(-) 4; TF2 1(DAT2) 8(DAT1) 9(CD); U1 8(GPIO10) 28(GPIO27) 33(SWCLK) 34(SWDIO) 36(GPIO28) 37(GPIO29) 47(GPIO38) 48(GPIO39) 56(GPIO45_ADC5) 57(GPIO46_ADC6) 58(GPIO47_ADC7) 59(ADC_AVDD) 68(USB_OTP_VDD); U4 2(ASDX) 3(ASCX) 9(INT2) 10(OCSB) 11(OSDO); U31 2(DOUT); U42 2(DOUT); U43 7(ALERT) 10(VS) 13(NC); U45 4(SS) 6(VCC); U46 4(NC); U47 4(NC); USB1 3(SBU2) 9(SBU1) 13(SHELL) 14(SHELL)
